# EAGLE design Clock Circuit (EAGLE 7.5.0)
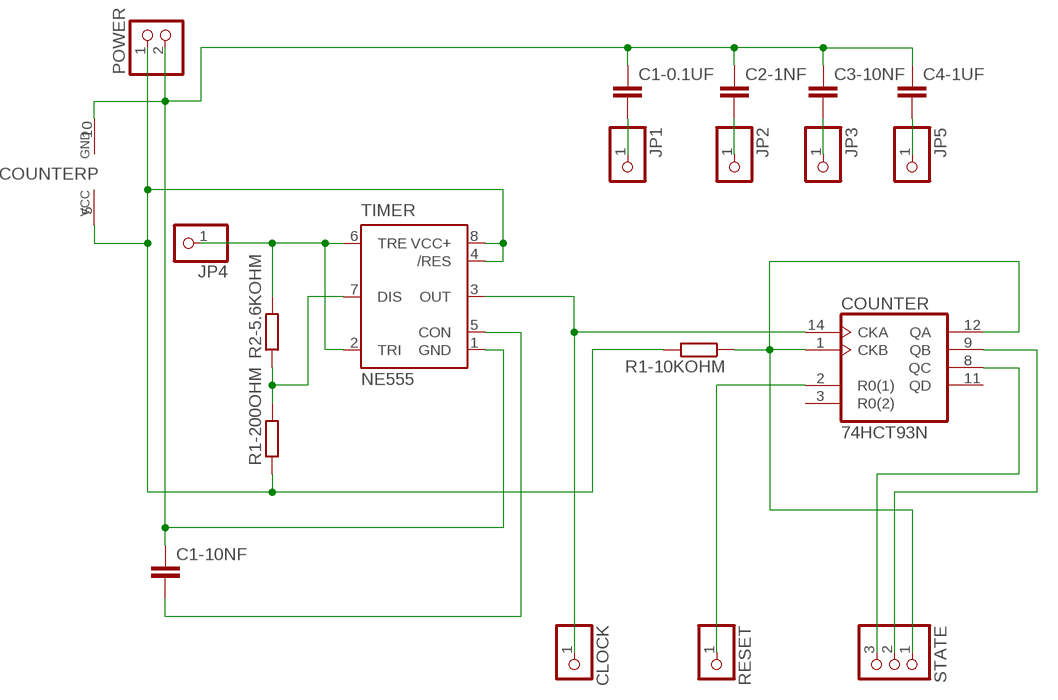
[diagram p0: schematic, sheet 1]

## Parts
C1-0.1UF  C-EU050-025X075  [C050-025X075]
C1-10NF  C-EU050-025X075  [C050-025X075]
C2-1NF  C-EU050-025X075  [C050-025X075]
C3-10NF  C-EU050-025X075  [C050-025X075]
C4-1UF  C-EU050-025X075  [C050-025X075]
CLOCK  PINHD-1X1  [1X01]
COUNTER  74HCT93N  [DIL14]
JP1  PINHD-1X1  [1X01]
JP2  PINHD-1X1  [1X01]
JP3  PINHD-1X1  [1X01]
JP4  PINHD-1X1  [1X01]
JP5  PINHD-1X1  [1X01]
POWER  PINHD-1X2  [1X02]
R1-10KOHM  R-EU_0207/10  [0207/10]
R1-200OHM  R-EU_0207/10  [0207/10]
R2-5.6KOHM  R-EU_0207/10  [0207/10]
RESET  PINHD-1X1  [1X01]
STATE  PINHD-1X3  [1X03]
TIMER  NE555  [DIL-08]

## Nets
GND: C1-0.1UF.1 C1-10NF.1 C2-1NF.1 C3-10NF.1 C4-1UF.1 COUNTER.10(GND) POWER.2 TIMER.1(GND)
N$1: CLOCK.1 COUNTER.14(CKA) TIMER.3(OUT)
N$2: JP4.1 R2-5.6KOHM.2 TIMER.2(TRI) TIMER.6(TRE)
N$3: COUNTER.1(CKB) COUNTER.12(QA) R1-10KOHM.1 STATE.1
N$4: COUNTER.2(R0(1)) RESET.1
N$5: COUNTER.8(QC) STATE.3
N$6: COUNTER.9(QB) STATE.2
N$7: C1-10NF.2 TIMER.5(CON)
N$8: C1-0.1UF.2 JP1.1
N$9: C2-1NF.2 JP2.1
N$10: C3-10NF.2 JP3.1
N$11: C4-1UF.2 JP5.1
N$12: R1-200OHM.2 R2-5.6KOHM.1 TIMER.7(DIS)
VCC: COUNTER.5(VCC) POWER.1 R1-10KOHM.2 R1-200OHM.1 TIMER.4(/RES) TIMER.8(VCC+)
Unconnected: COUNTER.3(R0(2)) COUNTER.11(QD)

## Library data of the parts
C1-0.1UF C1-10NF C2-1NF C3-10NF C4-1UF = resistor:C-EU: CAPACITOR, European symbol
CLOCK JP1-JP5 RESET = pinhead:PINHD-1X1: PIN HEADER
COUNTER = 74xx-eu:74*93: Decade, divide by twelve and binary COUNTER
POWER = pinhead:PINHD-1X2: PIN HEADER
R1-10KOHM R1-200OHM R2-5.6KOHM = rcl:R-EU_: RESISTOR, European symbol
STATE = pinhead:PINHD-1X3: PIN HEADER
TIMER = st-microelectronics:NE555: General purpose bipolar Timer; MF: Arrow Electronics; MPN: NE555N; OC_FARNELL: 1467742; OC_NEWARK: 89K1486

## Board
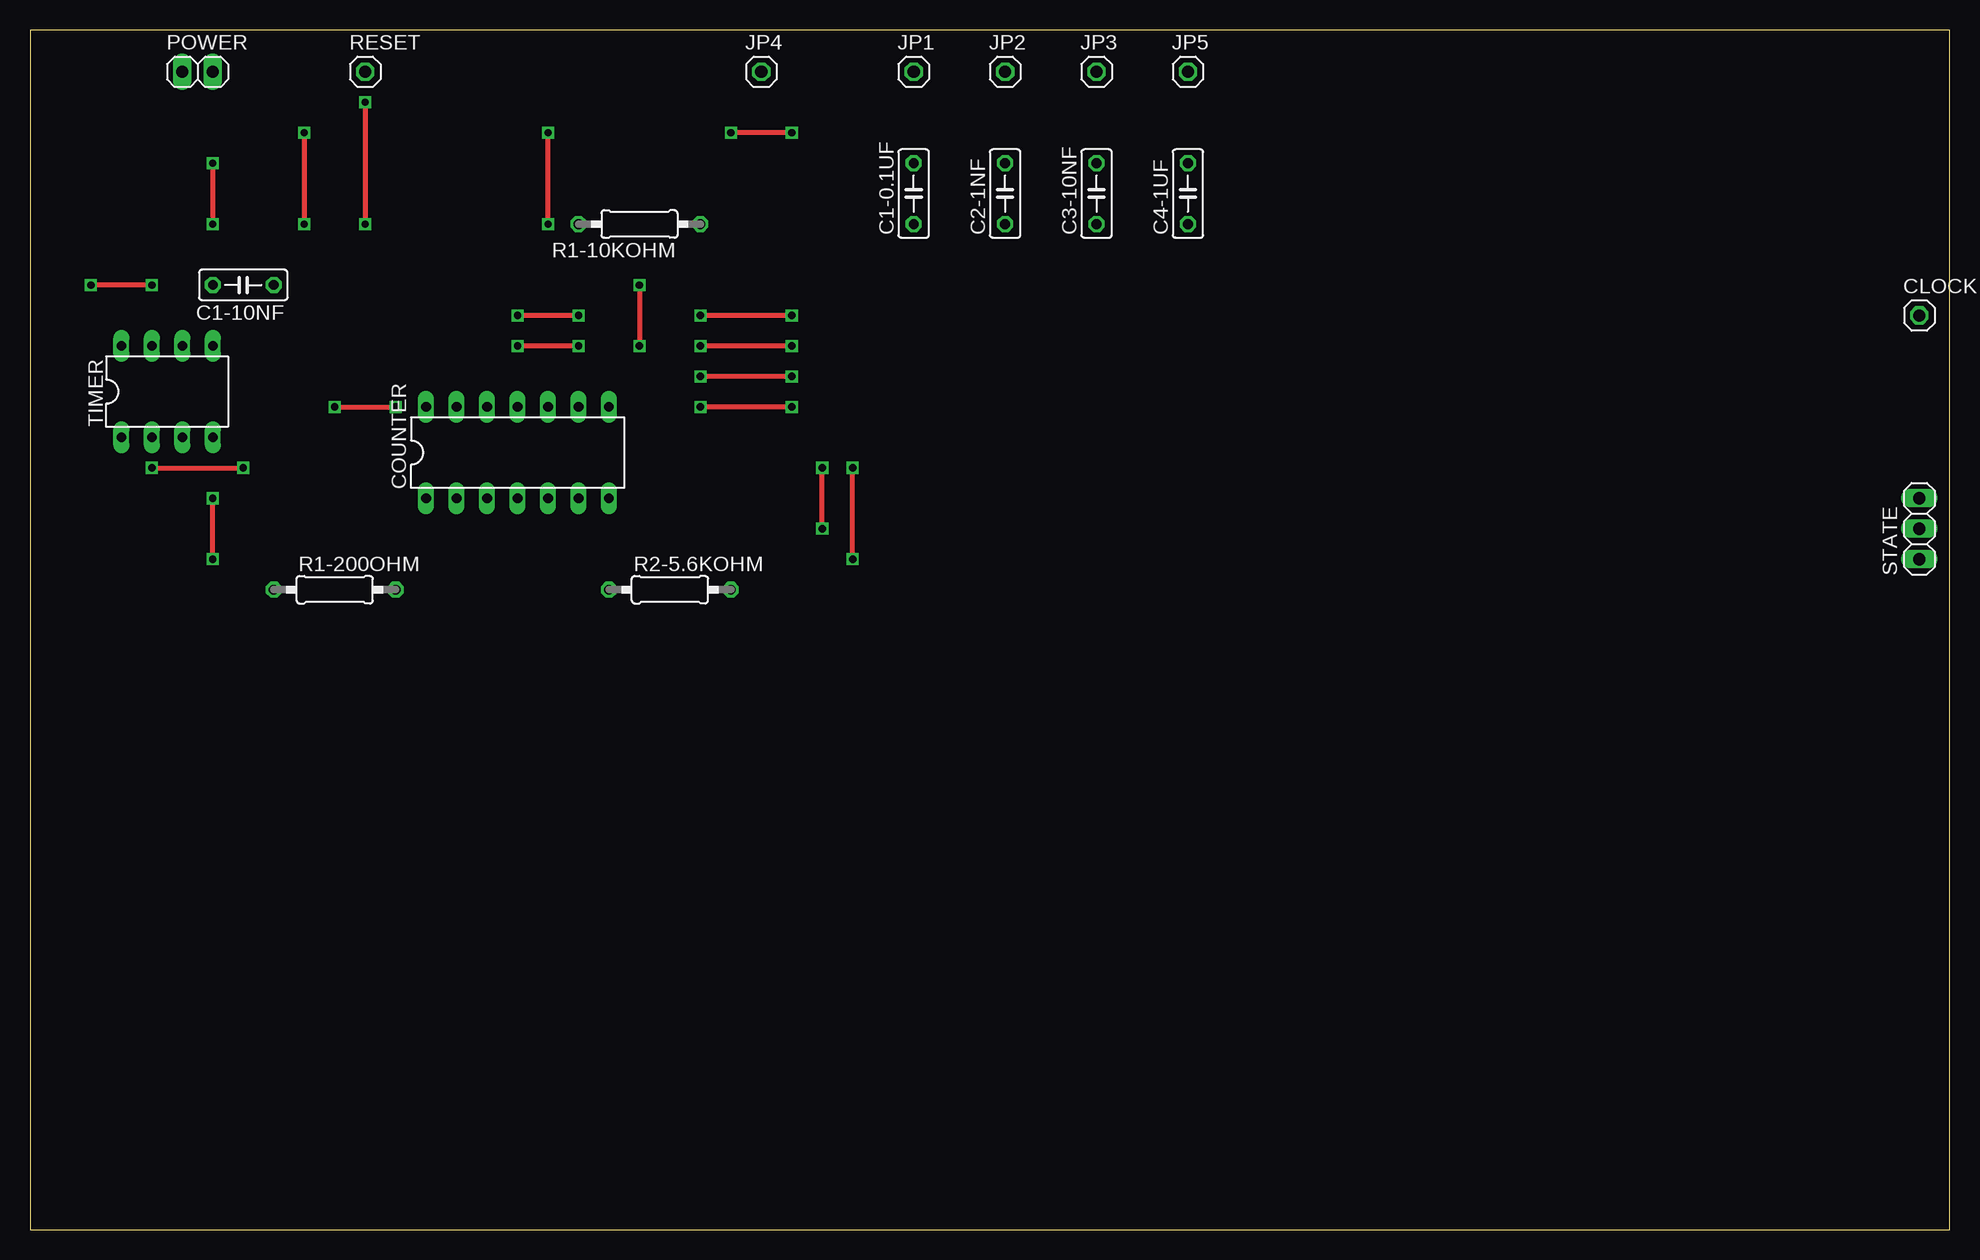
[diagram p1: board, top side]
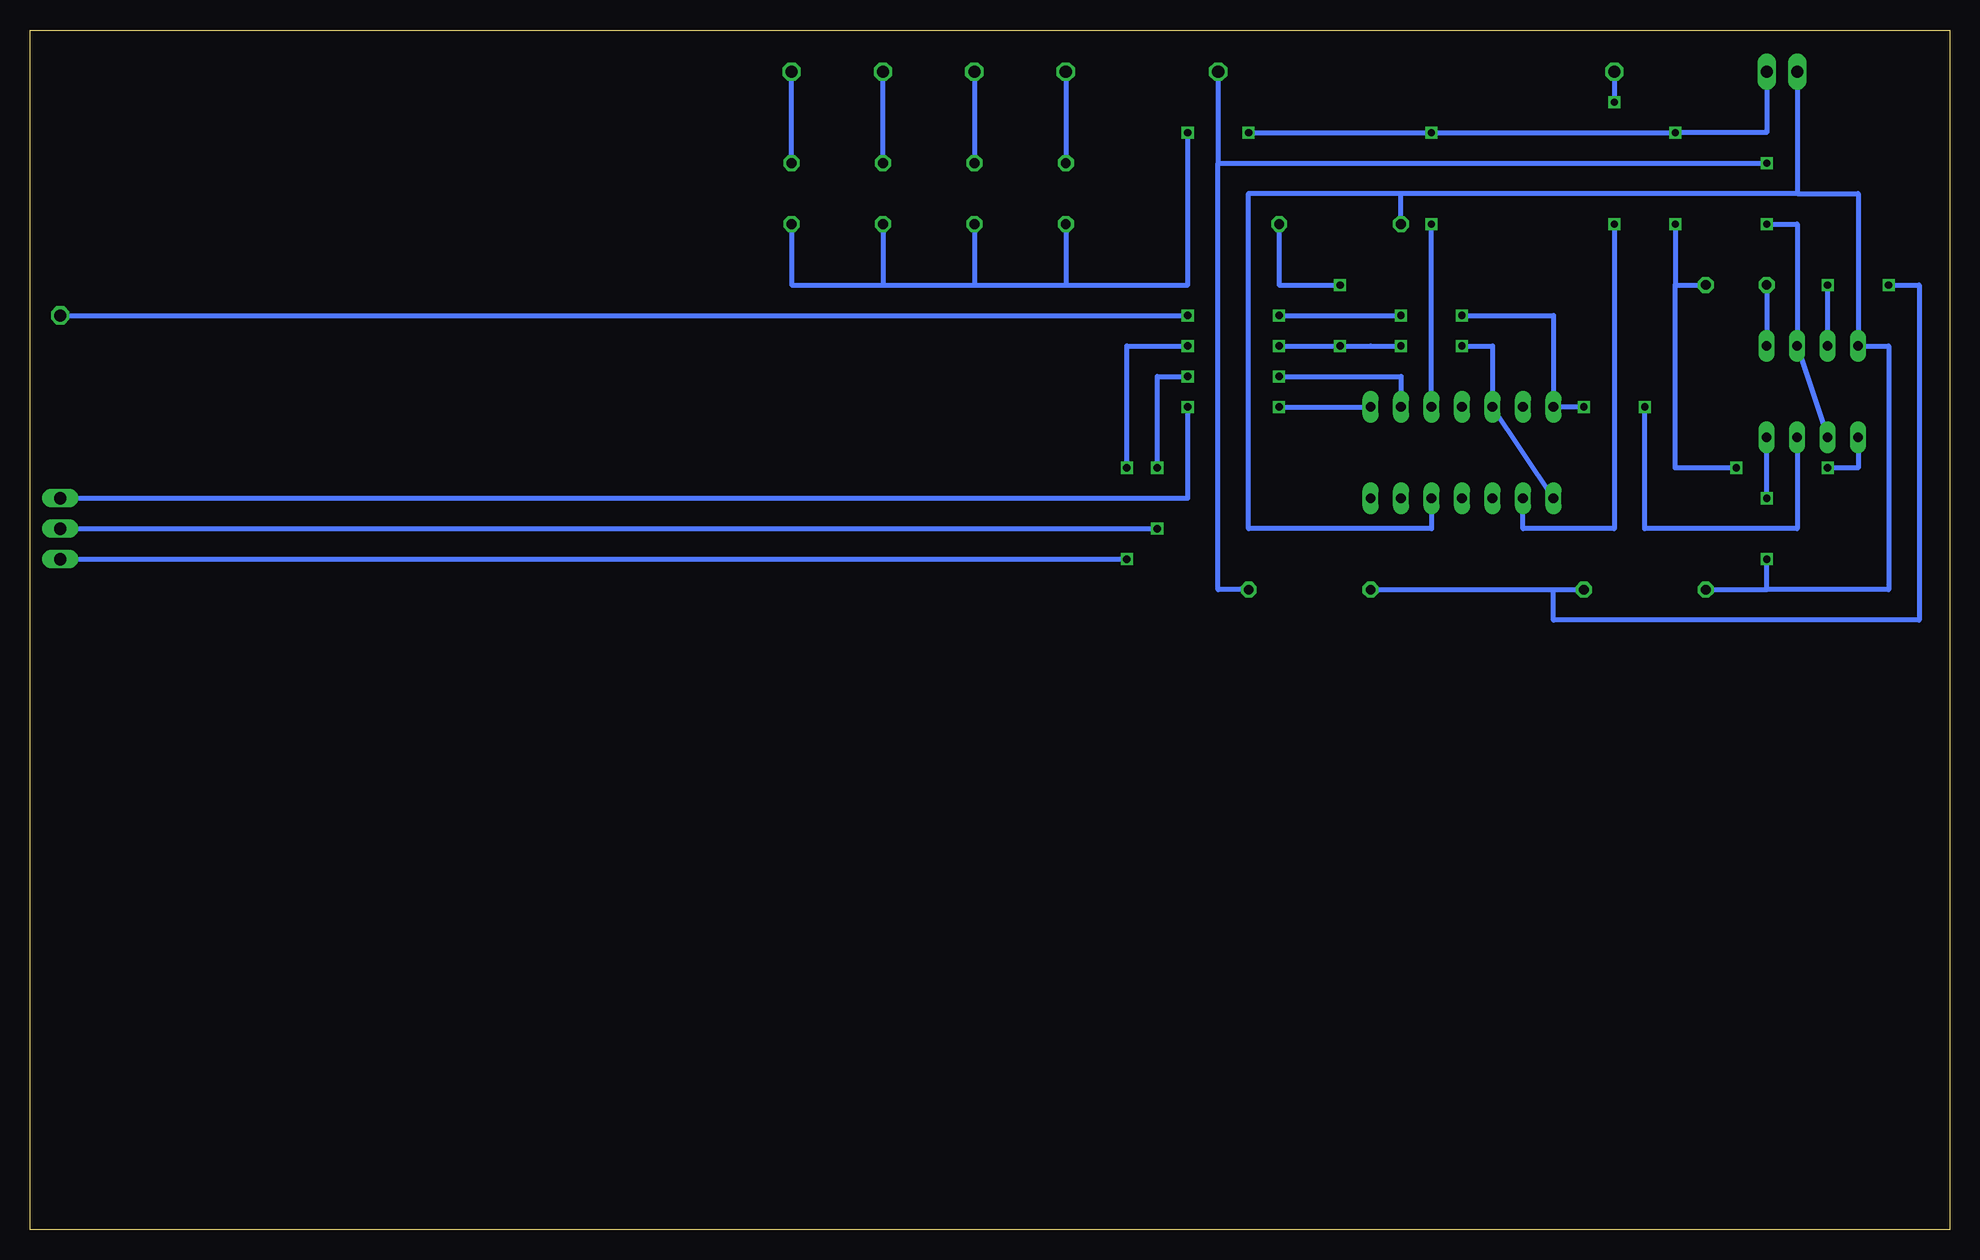
[diagram p2: board, bottom side, seen from below]

Size 160 x 100 mm. Coordinates in mm from the lower left corner, seen from the top.
Outline: 0,0 160,0 160,100 0,100 0,0
Copper layers (1*16): Top 0.035mm / dielectric 1.5mm / Bottom 0.035mm
Design rules "default": minimum track width 10mil, minimum drill 24mil, track to track 8mil, track to pad 8mil, pad to pad 8mil, via to via 8mil, smd to smd 8mil, copper to edge 40mil, drill to drill 8mil, minimum pad ring 10mil, minimum via ring 8mil, stop-mask expansion 4mil, vias tented up to drill 0mil, thermal gap 10mil

### Footprints (pad centres in the part's own frame; a part is rotated, then mirrored left to right if it is on the bottom)
C050-025X075 = drill 0.813 octagon: 1 -2.54,0; 2 2.54,0
1X01 = drill 1.016 octagon: 1 0,0
DIL14 = drill 0.813 long: 1 -7.62,-3.81; 2 -5.08,-3.81; 3 -2.54,-3.81; 4 0,-3.81; 5 2.54,-3.81; 6 5.08,-3.81; 7 7.62,-3.81; 8 7.62,3.81; 9 5.08,3.81; 10 2.54,3.81; 11 0,3.81; 12 -2.54,3.81; 13 -5.08,3.81; 14 -7.62,3.81
1X02 = drill 1.016 long: 1 -1.27,0; 2 1.27,0
0207/10 = drill 0.813 octagon: 1 -5.08,0; 2 5.08,0
1X03 = drill 1.016 long: 1 -2.54,0; 2 0,0; 3 2.54,0
DIL-08 = drill 0.813 long: 1 -3.81,-3.81; 2 -1.27,-3.81; 3 1.27,-3.81; 4 3.81,-3.81; 5 3.81,3.81; 6 1.27,3.81; 7 -1.27,3.81; 8 -3.81,3.81

### Placement (x,y rotation side)
C1-0.1UF  73.66,86.36 90 top
C1-10NF  17.78,78.74 180 top
C2-1NF  81.28,86.36 90 top
C3-10NF  88.9,86.36 90 top
C4-1UF  96.52,86.36 90 top
CLOCK  157.48,76.2 0 top
COUNTER  40.64,64.77 0 top
JP1  73.66,96.52 0 top
JP2  81.28,96.52 0 top
JP3  88.9,96.52 0 top
JP4  60.96,96.52 0 top
JP5  96.52,96.52 0 top
POWER  13.97,96.52 0 top
R1-10KOHM  50.8,83.82 180 top
R1-200OHM  25.4,53.34 0 top
R2-5.6KOHM  53.34,53.34 0 top
RESET  27.94,96.52 0 top
STATE  157.48,58.42 90 top
TIMER  11.43,69.85 0 top

### Tracks (layer width: path | path; a pad name or v marks a point on that pad's centre or on a via)
GND  (via drill 0.6)
  Top 0.406: v10.16,63.5 v17.78,63.5 | v22.86,91.44 v22.86,83.82 | v63.5,91.44 v58.42,91.44 | v43.18,83.82 v43.18,91.44
  Bottom 0.406: TIMER.1 7.62,63.5 v10.16,63.5 | v17.78,63.5 22.86,63.5 22.86,78.74 | 22.86,78.74 C1-10NF.1 | POWER.2 15.24,91.44 v22.86,91.44 v43.18,91.44 v58.42,91.44 | v22.86,83.82 22.86,78.74 | C4-1UF.1 96.52,78.74 88.9,78.74 | 88.9,78.74 81.28,78.74 | 81.28,78.74 73.66,78.74 | 73.66,78.74 63.5,78.74 v63.5,91.44 | C3-10NF.1 88.9,78.74 | C2-1NF.1 81.28,78.74 | C1-0.1UF.1 73.66,78.74 | COUNTER.10 v43.18,83.82
N$1  (via drill 0.6)
  Top 0.406: v25.4,68.58 v30.48,68.58 | v63.5,76.2 v55.88,76.2 | v45.72,76.2 v40.64,76.2
  Bottom 0.406: TIMER.3 12.7,58.42 25.4,58.42 v25.4,68.58 | v30.48,68.58 COUNTER.14 33.02,76.2 v40.64,76.2 | CLOCK.1 v63.5,76.2 | v55.88,76.2 v45.72,76.2
N$2  (via drill 0.6)
  Top 0.406: v15.24,88.9 v15.24,83.82
  Bottom 0.406: JP4.1 60.96,88.9 | 60.96,88.9 v15.24,88.9 | v15.24,83.82 12.7,83.82 TIMER.6 TIMER.2 | R2-5.6KOHM.2 60.96,53.34 60.96,88.9
N$3  (via drill 0.6)
  Top 0.406: v68.58,55.88 v68.58,63.5 | v63.5,73.66 v55.88,73.66 | v45.72,73.66 v40.64,73.66 | v50.8,78.74 v50.8,73.66
  Bottom 0.406: COUNTER.1 COUNTER.12 38.1,73.66 v40.64,73.66 | STATE.1 v68.58,55.88 | v68.58,63.5 68.58,73.66 v63.5,73.66 | v55.88,73.66 v50.8,73.66 48.26,73.66 v45.72,73.66 | R1-10KOHM.1 55.88,78.74 v50.8,78.74
N$4  (via drill 0.6)
  Top 0.406: v27.94,93.98 v27.94,83.82
  Bottom 0.406: RESET.1 v27.94,93.98 | v27.94,83.82 27.94,58.42 35.56,58.42 COUNTER.2
N$5  (via drill 0.6)
  Top 0.406: v63.5,68.58 v55.88,68.58
  Bottom 0.406: STATE.3 63.5,60.96 v63.5,68.58 | v55.88,68.58 COUNTER.8
N$6  (via drill 0.6)
  Top 0.406: v66.04,58.42 v66.04,63.5 | v63.5,71.12 v55.88,71.12
  Bottom 0.406: STATE.2 v66.04,58.42 | v66.04,63.5 66.04,71.12 v63.5,71.12 | v55.88,71.12 45.72,71.12 COUNTER.9
N$7
  Bottom 0.406: C1-10NF.2 TIMER.5
N$8
  Bottom 0.406: JP1.1 C1-0.1UF.2
N$9
  Bottom 0.406: JP2.1 C2-1NF.2
N$10
  Bottom 0.406: C3-10NF.2 JP3.1
N$11
  Bottom 0.406: C4-1UF.2 JP5.1
N$12  (via drill 0.6)
  Top 0.406: v10.16,78.74 v5.08,78.74
  Bottom 0.406: R2-5.6KOHM.1 33.02,53.34 | 33.02,53.34 R1-200OHM.2 | TIMER.7 v10.16,78.74 | v5.08,78.74 2.54,78.74 2.54,50.8 33.02,50.8 33.02,53.34
VCC  (via drill 0.6)
  Top 0.406: v15.24,55.88 v15.24,60.96
  Bottom 0.406: POWER.1 12.7,86.36 | 12.7,86.36 7.62,86.36 TIMER.8 5.08,73.66 5.08,53.34 15.24,53.34 | R1-200OHM.1 15.24,53.34 | 15.24,53.34 v15.24,55.88 | v15.24,60.96 TIMER.4 | COUNTER.5 43.18,58.42 58.42,58.42 58.42,86.36 45.72,86.36 | 12.7,86.36 45.72,86.36 | R1-10KOHM.2 45.72,86.36